# Altium schematic sheet DecadeBox_2.SchDoc: RESISTOR DECADE BOX
size Letter; SheetNumber: 2; SheetTotal: 2
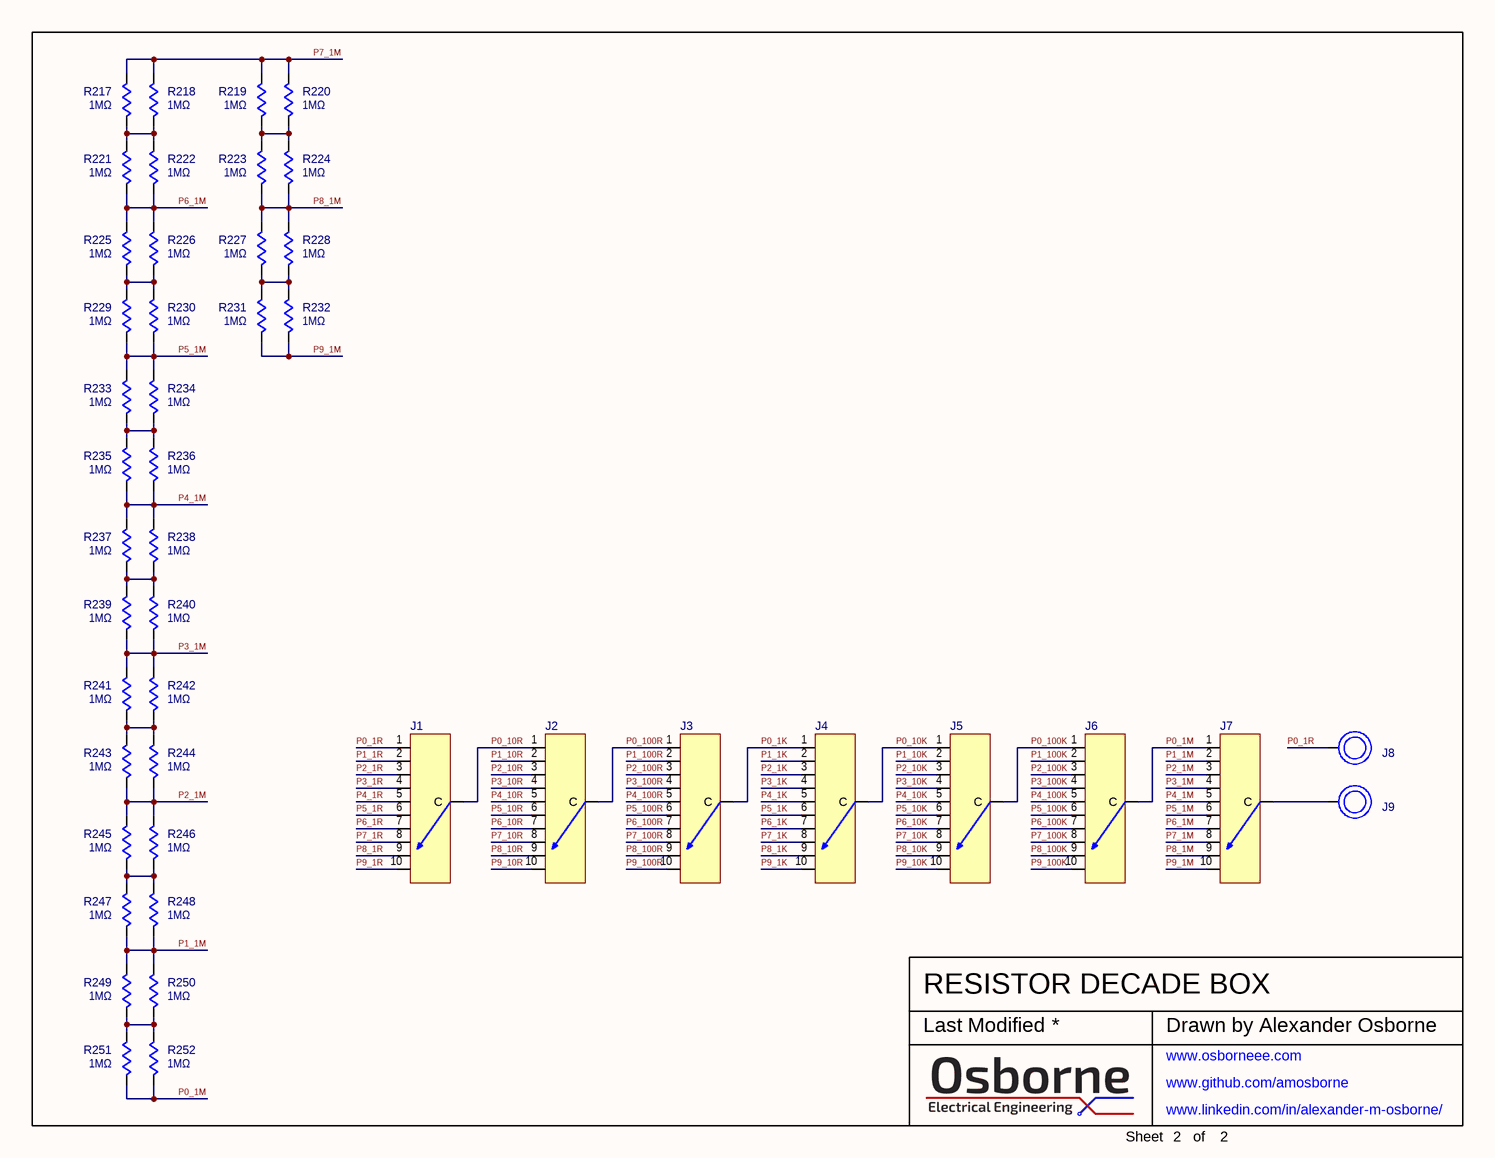
[diagram p0: DecadeBox_2.SchDoc]

## Parts
J1  706-56BDP36-01PAJS  [ROTARY]  (value not drawn)
J2  706-56BDP36-01PAJS  [ROTARY]  (value not drawn)
J3  706-56BDP36-01PAJS  [ROTARY]  (value not drawn)
J4  706-56BDP36-01PAJS  [ROTARY]  (value not drawn)
J5  706-56BDP36-01PAJS  [ROTARY]  (value not drawn)
J6  706-56BDP36-01PAJS  [ROTARY]  (value not drawn)
J7  706-56BDP36-01PAJS  [ROTARY]  (value not drawn)
J8  BINDING  (value not drawn)
J9  BINDING  (value not drawn)
R217  value 1MΩ  [MRS25]  (hidden comment: 56-MRS25000C1004FRP00CT-ND)
R218  value 1MΩ  [MRS25]  (hidden comment: 56-MRS25000C1004FRP00CT-ND)
R219  value 1MΩ  [MRS25]  (hidden comment: 56-MRS25000C1004FRP00CT-ND)
R220  value 1MΩ  [MRS25]  (hidden comment: 56-MRS25000C1004FRP00CT-ND)
R221  value 1MΩ  [MRS25]  (hidden comment: 56-MRS25000C1004FRP00CT-ND)
R222  value 1MΩ  [MRS25]  (hidden comment: 56-MRS25000C1004FRP00CT-ND)
R223  value 1MΩ  [MRS25]  (hidden comment: 56-MRS25000C1004FRP00CT-ND)
R224  value 1MΩ  [MRS25]  (hidden comment: 56-MRS25000C1004FRP00CT-ND)
R225  value 1MΩ  [MRS25]  (hidden comment: 56-MRS25000C1004FRP00CT-ND)
R226  value 1MΩ  [MRS25]  (hidden comment: 56-MRS25000C1004FRP00CT-ND)
R227  value 1MΩ  [MRS25]  (hidden comment: 56-MRS25000C1004FRP00CT-ND)
R228  value 1MΩ  [MRS25]  (hidden comment: 56-MRS25000C1004FRP00CT-ND)
R229  value 1MΩ  [MRS25]  (hidden comment: 56-MRS25000C1004FRP00CT-ND)
R230  value 1MΩ  [MRS25]  (hidden comment: 56-MRS25000C1004FRP00CT-ND)
R231  value 1MΩ  [MRS25]  (hidden comment: 56-MRS25000C1004FRP00CT-ND)
R232  value 1MΩ  [MRS25]  (hidden comment: 56-MRS25000C1004FRP00CT-ND)
R233  value 1MΩ  [MRS25]  (hidden comment: 56-MRS25000C1004FRP00CT-ND)
R234  value 1MΩ  [MRS25]  (hidden comment: 56-MRS25000C1004FRP00CT-ND)
R235  value 1MΩ  [MRS25]  (hidden comment: 56-MRS25000C1004FRP00CT-ND)
R236  value 1MΩ  [MRS25]  (hidden comment: 56-MRS25000C1004FRP00CT-ND)
R237  value 1MΩ  [MRS25]  (hidden comment: 56-MRS25000C1004FRP00CT-ND)
R238  value 1MΩ  [MRS25]  (hidden comment: 56-MRS25000C1004FRP00CT-ND)
R239  value 1MΩ  [MRS25]  (hidden comment: 56-MRS25000C1004FRP00CT-ND)
R240  value 1MΩ  [MRS25]  (hidden comment: 56-MRS25000C1004FRP00CT-ND)
R241  value 1MΩ  [MRS25]  (hidden comment: 56-MRS25000C1004FRP00CT-ND)
R242  value 1MΩ  [MRS25]  (hidden comment: 56-MRS25000C1004FRP00CT-ND)
R243  value 1MΩ  [MRS25]  (hidden comment: 56-MRS25000C1004FRP00CT-ND)
R244  value 1MΩ  [MRS25]  (hidden comment: 56-MRS25000C1004FRP00CT-ND)
R245  value 1MΩ  [MRS25]  (hidden comment: 56-MRS25000C1004FRP00CT-ND)
R246  value 1MΩ  [MRS25]  (hidden comment: 56-MRS25000C1004FRP00CT-ND)
R247  value 1MΩ  [MRS25]  (hidden comment: 56-MRS25000C1004FRP00CT-ND)
R248  value 1MΩ  [MRS25]  (hidden comment: 56-MRS25000C1004FRP00CT-ND)
R249  value 1MΩ  [MRS25]  (hidden comment: 56-MRS25000C1004FRP00CT-ND)
R250  value 1MΩ  [MRS25]  (hidden comment: 56-MRS25000C1004FRP00CT-ND)
R251  value 1MΩ  [MRS25]  (hidden comment: 56-MRS25000C1004FRP00CT-ND)
R252  value 1MΩ  [MRS25]  (hidden comment: 56-MRS25000C1004FRP00CT-ND)

## Nets
P0_1K: J3.11(C) J4.1
P0_1M: J6.11(C) J7.1 R251.2 R252.2
P0_1R: J1.1 J8.1
P0_10K: J4.11(C) J5.1
P0_10R: J1.11(C) J2.1
P0_100K: J5.11(C) J6.1
P0_100R: J2.11(C) J3.1
P1_1K: J4.2
P1_1M: J7.2 R247.2 R248.2 R249.1 R250.1
P1_1R: J1.2
P1_10K: J5.2
P1_10R: J2.2
P1_100K: J6.2
P1_100R: J3.2
P2_1K: J4.3
P2_1M: J7.3 R243.2 R244.2 R245.1 R246.1
P2_1R: J1.3
P2_10K: J5.3
P2_10R: J2.3
P2_100K: J6.3
P2_100R: J3.3
P3_1K: J4.4
P3_1M: J7.4 R239.2 R240.2 R241.1 R242.1
P3_1R: J1.4
P3_10K: J5.4
P3_10R: J2.4
P3_100K: J6.4
P3_100R: J3.4
P4_1K: J4.5
P4_1M: J7.5 R235.2 R236.2 R237.1 R238.1
P4_1R: J1.5
P4_10K: J5.5
P4_10R: J2.5
P4_100K: J6.5
P4_100R: J3.5
P5_1K: J4.6
P5_1M: J7.6 R229.2 R230.2 R233.1 R234.1
P5_1R: J1.6
P5_10K: J5.6
P5_10R: J2.6
P5_100K: J6.6
P5_100R: J3.6
P6_1K: J4.7
P6_1M: J7.7 R221.2 R222.2 R225.1 R226.1
P6_1R: J1.7
P6_10K: J5.7
P6_10R: J2.7
P6_100K: J6.7
P6_100R: J3.7
P7_1K: J4.8
P7_1M: J7.8 R217.1 R218.1 R219.1 R220.1
P7_1R: J1.8
P7_10K: J5.8
P7_10R: J2.8
P7_100K: J6.8
P7_100R: J3.8
P8_1K: J4.9
P8_1M: J7.9 R223.2 R224.2 R227.1 R228.1
P8_1R: J1.9
P8_10K: J5.9
P8_10R: J2.9
P8_100K: J6.9
P8_100R: J3.9
P9_1K: J4.10
P9_1M: J7.10 R231.2 R232.2
P9_1R: J1.10
P9_10K: J5.10
P9_10R: J2.10
P9_100K: J6.10
P9_100R: J3.10
NetJ7_11: J7.11(C) J9.1
NetR217_2: R217.2 R218.2 R221.1 R222.1
NetR219_2: R219.2 R220.2 R223.1 R224.1
NetR225_2: R225.2 R226.2 R229.1 R230.1
NetR227_2: R227.2 R228.2 R231.1 R232.1
NetR233_2: R233.2 R234.2 R235.1 R236.1
NetR237_2: R237.2 R238.2 R239.1 R240.1
NetR241_2: R241.2 R242.2 R243.1 R244.1
NetR245_2: R245.2 R246.2 R247.1 R248.1
NetR249_2: R249.2 R250.2 R251.1 R252.1

## Notes on the sheet
- Last Modified
- Drawn by Alexander Osborne
- www.osborneee.com <http://www.osborneee.com>
- www.github.com/amosborne <http://www.github.com/amosborne>
- Sheet
- www.linkedin.com/in/alexander-m-osborne/ <http://www.linkedin.com/in/alexander-m-osborne/>
- of

## Library data of the parts
J1-J7 = ROTARY: 10 POLE, SINGLE THROW, ROTARY SWITCH; Supplier 1: Mouser; Supplier Part Number 1: 706-56BDP36-01PAJS
J8 J9 = BINDING: BINDING POST
R217-R252 = RES-1MOHM: RES 1MΩ 1% 50ppm/K 600mW; Tolerance: 1% + 50ppm/K; Supplier 1: Digi-Key; Supplier Part Number 1: 56-MRS25000C1004FRP00CT-ND; Power: 600mW